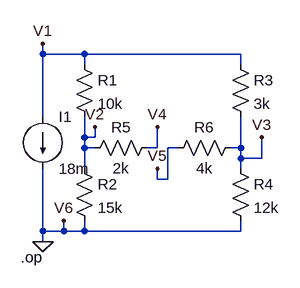
[diagram p0: schematic P_3-26.asc]
P_3-26.asc, the LTspice schematic file:
Version 4
SHEET 1 880 680
WIRE -48 48 -48 32
WIRE 16 48 -48 48
WIRE 256 48 16 48
WIRE 16 64 16 48
WIRE 256 64 256 48
WIRE -48 144 -48 48
WIRE 16 176 16 144
WIRE 32 176 32 160
WIRE 32 176 16 176
WIRE 16 192 16 176
WIRE 32 192 16 192
WIRE 128 192 128 160
WIRE 128 192 112 192
WIRE 160 192 144 192
WIRE 256 192 256 144
WIRE 256 192 240 192
WIRE 256 208 256 192
WIRE 288 208 288 176
WIRE 288 208 256 208
WIRE 16 224 16 192
WIRE 256 224 256 208
WIRE 128 240 128 224
WIRE 144 240 144 192
WIRE 144 240 128 240
WIRE -48 320 -48 224
WIRE -16 320 -16 304
WIRE -16 320 -48 320
WIRE 16 320 16 304
WIRE 16 320 -16 320
WIRE 256 320 256 304
WIRE 256 320 16 320
WIRE -48 336 -48 320
FLAG -48 336 0
FLAG -48 32 V1
FLAG 32 160 V2
FLAG 128 160 V4
FLAG 128 224 V5
FLAG 288 176 V3
FLAG -16 304 V6
SYMBOL current -48 144 R0
WINDOW 123 0 0 Left 2
WINDOW 39 0 0 Left 2
SYMATTR InstName I1
SYMATTR Value 18m
SYMBOL res 0 48 R0
SYMATTR InstName R1
SYMATTR Value 10k
SYMBOL res 0 208 R0
SYMATTR InstName R2
SYMATTR Value 15k
SYMBOL res 240 48 R0
SYMATTR InstName R3
SYMATTR Value 3k
SYMBOL res 240 208 R0
SYMATTR InstName R4
SYMATTR Value 12k
SYMBOL res 16 208 R270
WINDOW 0 32 56 VTop 2
WINDOW 3 0 56 VBottom 2
SYMATTR InstName R5
SYMATTR Value 2k
SYMBOL res 144 208 R270
WINDOW 0 32 56 VTop 2
WINDOW 3 0 56 VBottom 2
SYMATTR InstName R6
SYMATTR Value 4k
TEXT -82 360 Left 2 !.op

The netlist it stands for:
* P_3-26.asc
I1 V1 0 18m
R1 V1 V2 10k
R2 V2 0 15k
R3 V1 V3 3k
R4 V3 0 12k
R5 V2 V4 2k
R6 V5 V3 4k
.op
.backanno
.end

* Results of the author's LTspice run, read from the files saved beside the schematic
* Operating Point:
*   V(v1) = -168.8 V
*   V(v2) = -101.2 V
*   V(v3) = -135 V
*   V(v4) = -101.2 V
*   V(v5) = -135 V
*   I(I1) = 18 mA
*   I(R6) = 0 A
*   I(R5) = 0 A
*   I(R4) = -11.25 mA
*   I(R3) = -11.25 mA
*   I(R2) = -6.75 mA
*   I(R1) = -6.75 mA